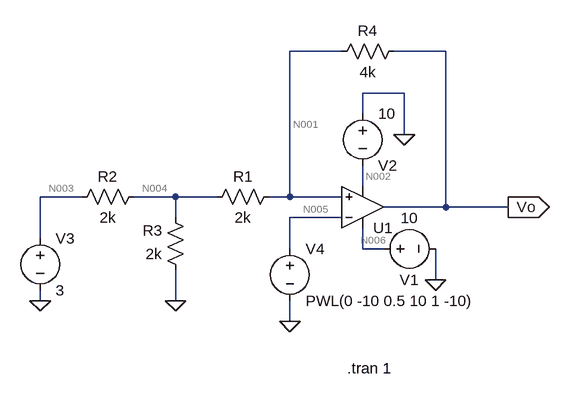
[diagram p0: schematic P1c.asc]
P1c.asc, the LTspice schematic file:
Version 4.1
SHEET 1 880 680
WIRE 192 -48 112 -48
WIRE 352 -48 272 -48
WIRE 288 16 224 16
WIRE 224 48 224 16
WIRE 288 80 288 16
WIRE 224 160 224 128
WIRE -208 176 -272 176
WIRE -64 176 -128 176
WIRE 0 176 -64 176
WIRE 112 176 112 -48
WIRE 112 176 80 176
WIRE 192 176 112 176
WIRE 352 192 352 -48
WIRE 352 192 256 192
WIRE 448 192 352 192
WIRE -64 208 -64 176
WIRE 192 208 112 208
WIRE -272 240 -272 176
WIRE 112 256 112 208
WIRE 224 256 224 224
WIRE 256 256 224 256
WIRE 336 304 336 256
WIRE -272 336 -272 320
WIRE -64 336 -64 288
WIRE 112 368 112 336
FLAG 336 304 0
FLAG 288 80 0
FLAG -272 336 0
FLAG -64 336 0
FLAG 448 192 Vo
IOPIN 448 192 Out
FLAG 112 368 0
SYMBOL OpAmps\\UniversalOpAmp2 224 192 M180
SYMATTR InstName U1
SYMBOL voltage 224 32 R0
WINDOW 0 24 96 Left 2
WINDOW 3 24 16 Left 2
WINDOW 123 0 0 Left 0
WINDOW 39 0 0 Left 0
SYMATTR InstName V2
SYMATTR Value 10
SYMBOL res 96 160 R90
WINDOW 0 0 56 VBottom 2
WINDOW 3 32 56 VTop 2
SYMATTR InstName R1
SYMATTR Value 2k
SYMBOL res -112 160 R90
WINDOW 0 0 56 VBottom 2
WINDOW 3 32 56 VTop 2
SYMATTR InstName R2
SYMATTR Value 2k
SYMBOL res -48 304 R180
WINDOW 0 36 76 Left 2
WINDOW 3 36 40 Left 2
SYMATTR InstName R3
SYMATTR Value 2k
SYMBOL res 176 -32 R270
WINDOW 0 32 56 VTop 2
WINDOW 3 0 56 VBottom 2
SYMATTR InstName R4
SYMATTR Value 4k
SYMBOL voltage -272 224 R0
WINDOW 123 0 0 Left 0
WINDOW 39 0 0 Left 0
SYMATTR InstName V3
SYMATTR Value 3
SYMBOL voltage 112 240 R0
WINDOW 123 0 0 Left 0
WINDOW 39 0 0 Left 0
SYMATTR InstName V4
SYMATTR Value PWL(0 -10 0.5 10 1 -10)
SYMBOL voltage 240 256 R270
WINDOW 0 -32 56 VBottom 2
WINDOW 3 32 56 VTop 2
WINDOW 123 0 0 Left 0
WINDOW 39 0 0 Left 0
SYMATTR InstName V1
SYMATTR Value 10
TEXT 200 440 Left 2 !.tran 1

The netlist it stands for:
* P1c.asc
X§U1 N001 N005 N006 N002 Vo level2 Avol=1Meg GBW=10Meg Slew=10Meg Ilimit=25m Rail=0 Vos=0 En=0 Enk=0 In=0 Ink=0 Rin=500Meg  ; pins In+ In- V+ V- OUT
V2 0 N002 10
R1 N001 N004 2k
R2 N004 N003 2k
R3 0 N004 2k
R4 N001 Vo 4k
V3 N003 0 3
V4 N005 0 PWL(0 -10 0.5 10 1 -10)
V1 N006 0 10
.tran 1
.lib UniversalOpAmp2.lib
.backanno
.end

* Results of the author's LTspice run, read from the files saved beside the schematic
* Operating Point, zero values left out:
*   V(n001) = 5.137 V
*   V(n002) = -10 V
*   V(n003) = 3 V
*   V(n004) = 2.712 V
*   V(n005) = -10 V
*   V(n006) = 10 V
*   V(vo) = 9.987 V
*   I(R1) = 1.212 mA
*   I(R2) = -143.8 µA
*   I(R3) = -1.356 mA
*   I(R4) = -1.212 mA
*   I(V1) = -1.215 mA
*   I(V2) = -2.248 µA
*   I(V3) = -143.8 µA
*   I(V4) = 20 nA
*   Ix(u1:1) = 10.27 nA
*   Ix(u1:2) = -20 nA
*   Ix(u1:3) = 1.215 mA
*   Ix(u1:4) = -2.248 µA
*   Ix(u1:5) = -1.212 mA
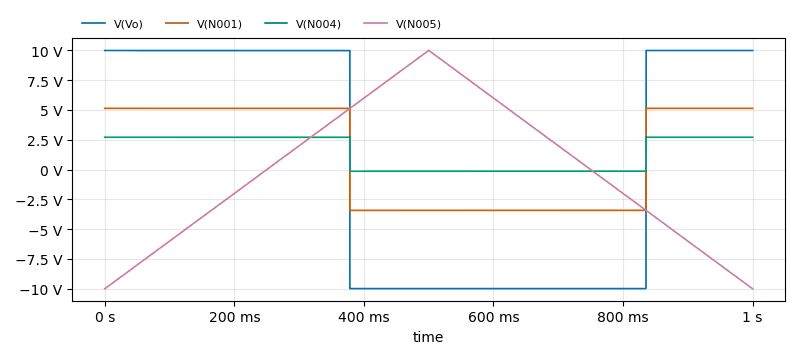
[diagram p1: Transient Analysis of P1c.asc, plotted from the saved traces]
* Transient Analysis, 1 run:
*   V(Vo): min -9.983 V, max 9.987 V, average 859.4 mV, rms 9.985 V, last 9.987 V
*   V(N001): min -3.421 V, max 5.137 V, average 1.225 V, rms 4.436 V, last 5.137 V
*   V(N004): min -140.4 mV, max 2.712 V, average 1.408 V, rms 2.001 V, last 2.712 V
*   V(N005): min -10 V, max 10 V, average 0 V, rms 5.774 V, last -10 V